# EAGLE design uBlox_camM8_breakout (EAGLE 7.7.0)
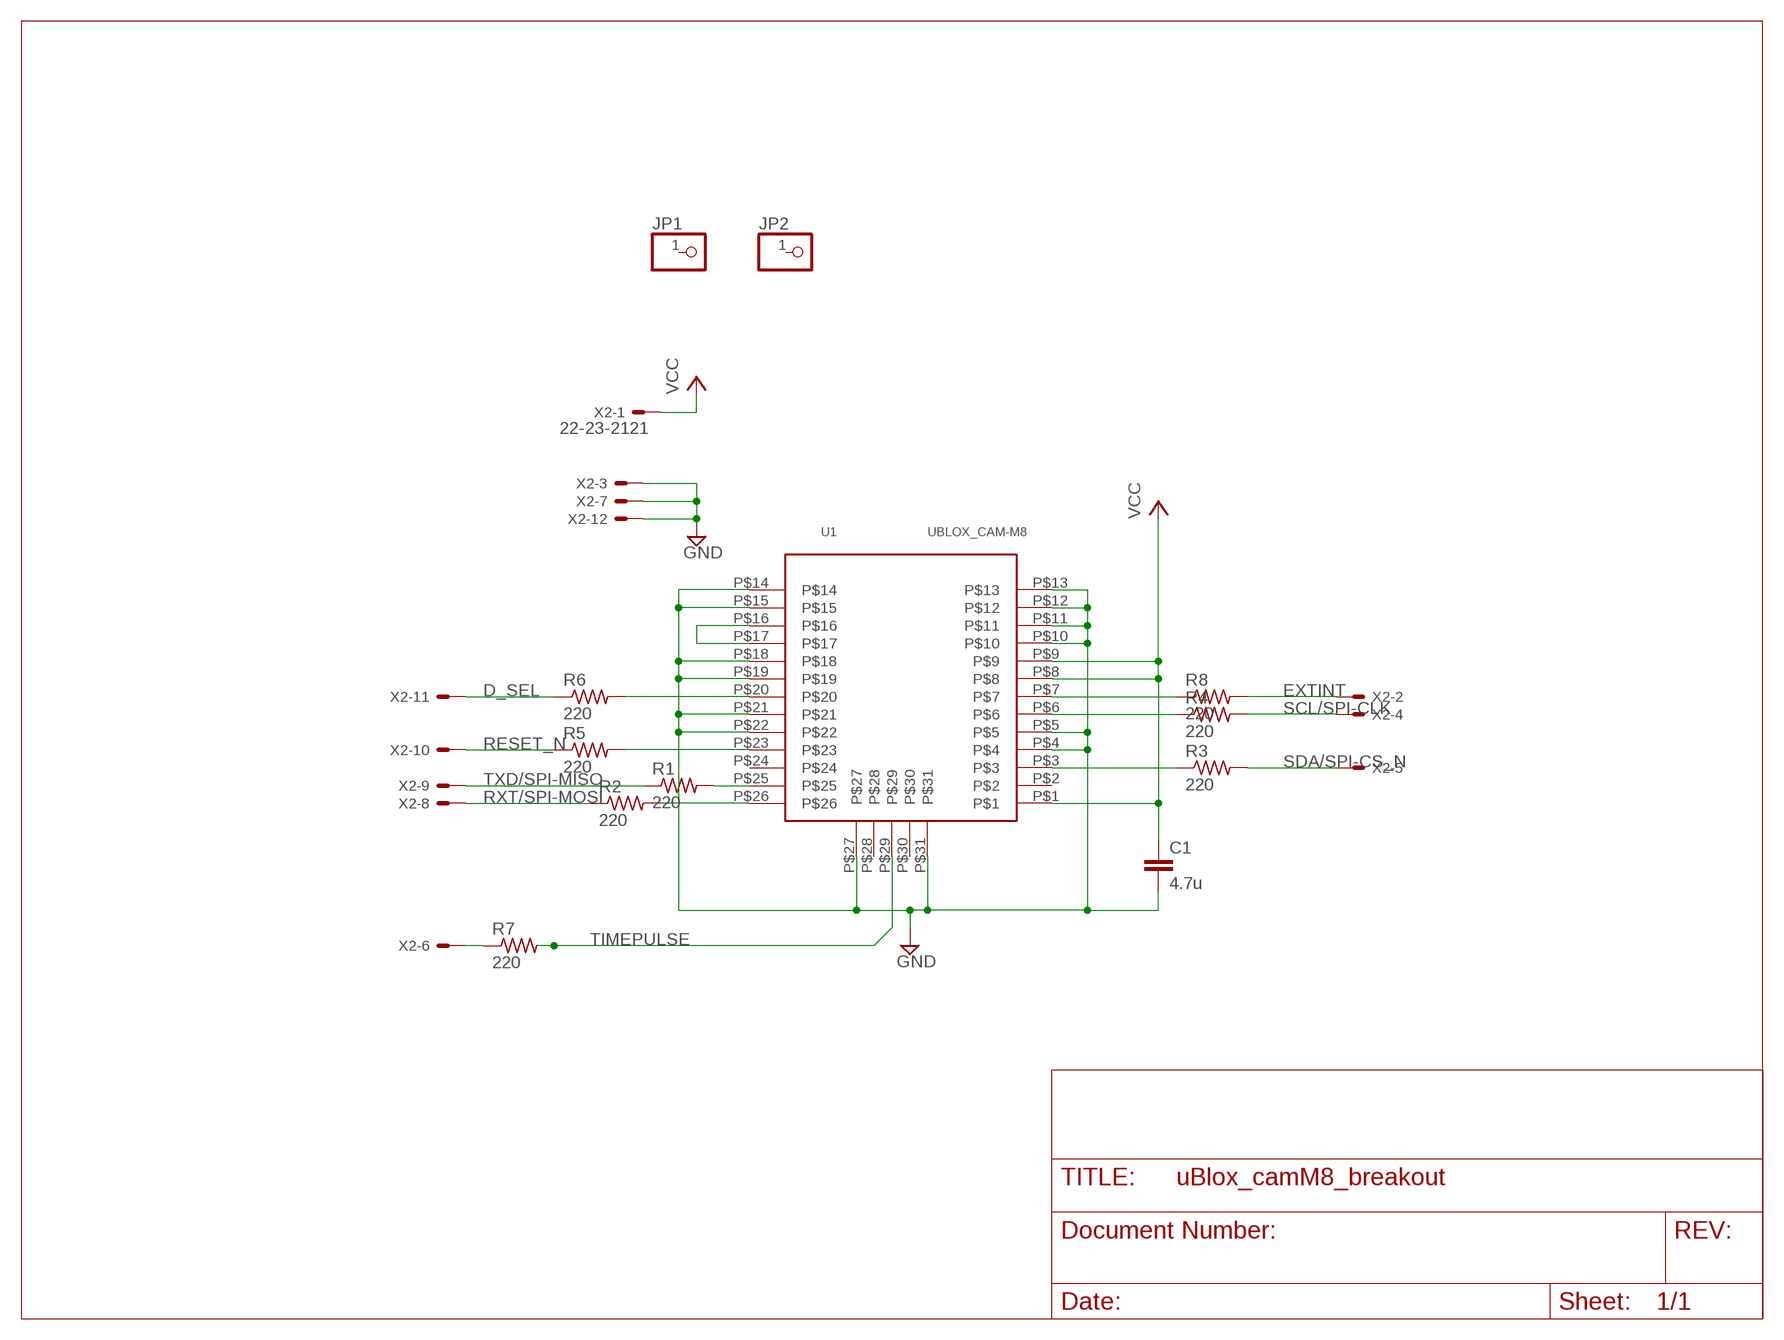
[diagram p0: schematic, sheet 1]

## Parts
C1  4.7u  C-EUC0805  [C0805]
JP1  PINHD-1X1  [1X01]
JP2  PINHD-1X1  [1X01]
R1  220  R-US_R0402  [R0402]
R2  220  R-US_R0402  [R0402]
R3  220  R-US_R0402  [R0402]
R4  220  R-US_R0402  [R0402]
R5  220  R-US_R0402  [R0402]
R6  220  R-US_R0402  [R0402]
R7  220  R-US_R0402  [R0402]
R8  220  R-US_R0402  [R0402]
U1  UBLOX_CAM-M8  [UBLOX_CAM-M8]
X2  22-23-2121  [22-23-2121]

## Nets
D_SEL: R6.1 X2.11
EXTINT: R8.2 X2.2
GND: C1.2 U1.P$4 U1.P$5 U1.P$10 U1.P$11 U1.P$12 U1.P$13 U1.P$14 U1.P$15 U1.P$18 U1.P$19 U1.P$21 U1.P$22 U1.P$27 U1.P$31 X2.3 X2.7 X2.12
N$1: R1.2 U1.P$25
N$2: R2.2 U1.P$26
N$3: U1.P$16 U1.P$17
N$4: R3.1 U1.P$3
N$5: R4.1 U1.P$6
N$6: R8.1 U1.P$7
N$7: R5.2 U1.P$23
N$11: R6.2 U1.P$20
N$14: R7.1 X2.6
RESET_N: R5.1 X2.10
RXT/SPI-MOSI: R2.1 X2.8
SCL/SPI-CLK: R4.2 X2.4
SDA/SPI-CS_N: R3.2 X2.5
TIMEPULSE: R7.2 U1.P$29
TXD/SPI-MISO: R1.1 X2.9
VCC: C1.1 U1.P$1 U1.P$8 U1.P$9 X2.1
Unconnected: JP1.1 JP2.1 U1.P$2 U1.P$24 U1.P$28 U1.P$30

## Library data of the parts
C1 = rcl:C-EU: CAPACITOR, European symbol
JP1 JP2 = pinhead:PINHD-1X1: PIN HEADER
R1-R8 = resistor:R-US_: RESISTOR, American symbol
U1 = uBlox:UBLOX_CAM-M8
X2 = con-molex:22-23-2121: .100" (2.54mm) Center Header - 12 Pin; MF: MOLEX; MPN: 22-23-2121; OC_FARNELL: 1462935; OC_NEWARK: 56H0456

## Board
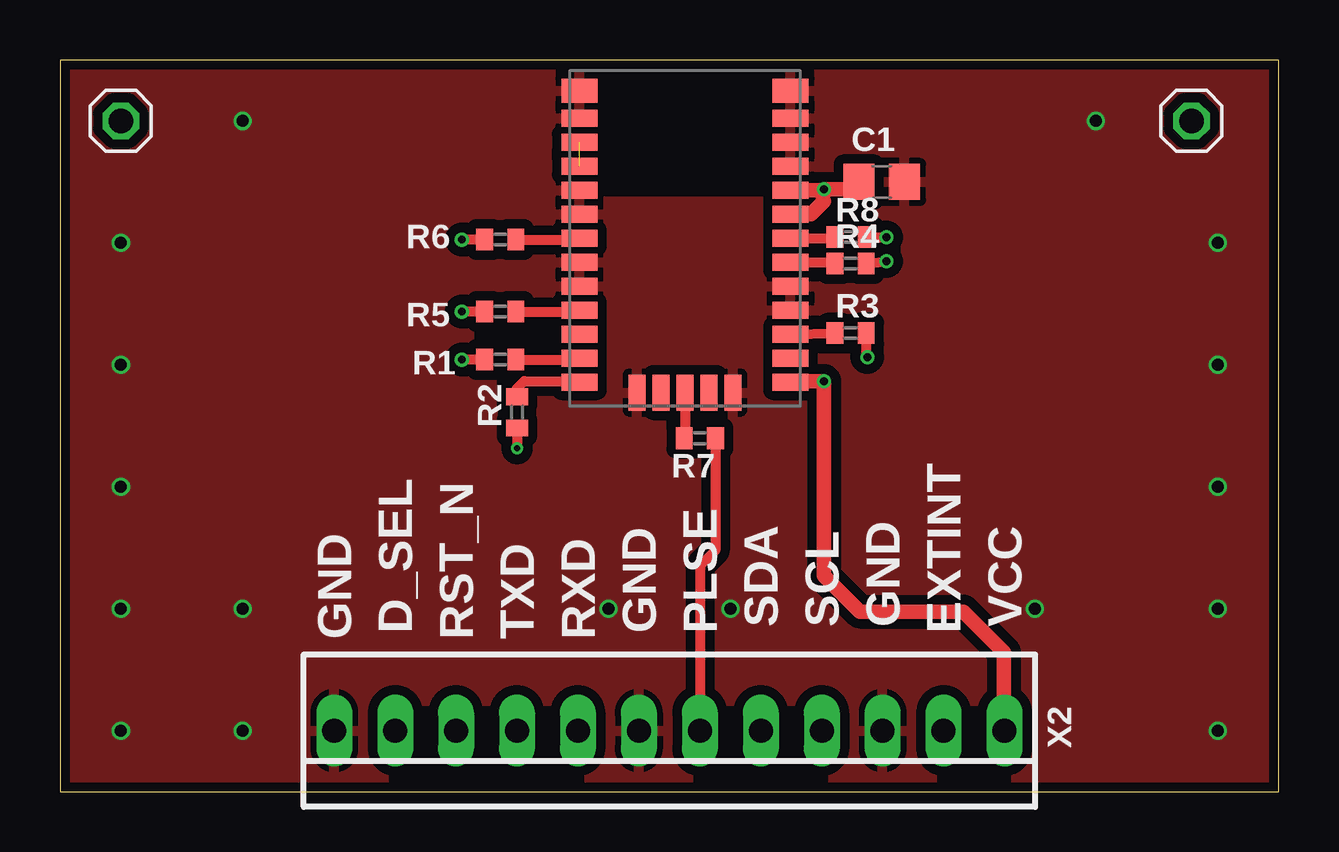
[diagram p1: board, top side]
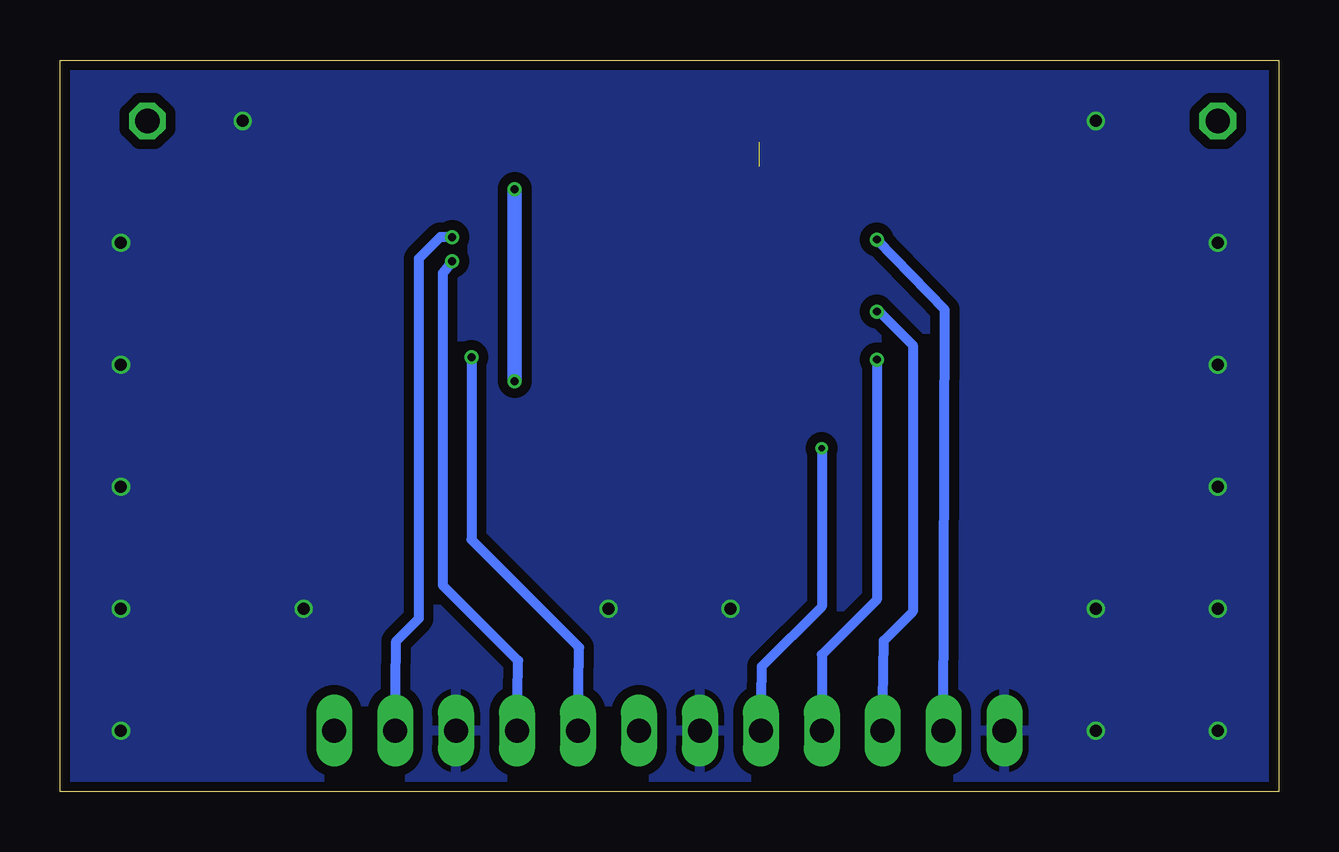
[diagram p2: board, bottom side, seen from below]

Size 50.8 x 30.48 mm. Coordinates in mm from the lower left corner, seen from the top.
Outline: 0,0 50.8,0 50.8,30.48 0,30.48 0,0
Copper layers (1*16): Top 0.035559375mm / dielectric 1.6mm / Bottom 0.035559375mm
Design rules "oshpark-2layer *": minimum track width 6mil, minimum drill 10mil, track to track 6mil, track to pad 6mil, pad to pad 6mil, via to via 6mil, smd to smd 3mil, copper to edge 15mil, drill to drill 6mil, minimum pad ring 5mil, minimum via ring 5mil, stop-mask expansion 2.5mil, vias tented up to drill 20mil, thermal gap 10mil

### Footprints (pad centres in the part's own frame; a part is rotated, then mirrored left to right if it is on the bottom)
C0805 = smd 1.3 x 1.5: 1 -0.95,0; 2 0.95,0
1X01 = drill 1.016 octagon: 1 0,0
R0402 = smd 0.7 x 0.9: 1 -0.65,0; 2 0.65,0
UBLOX_CAM-M8 = smd 0.7 x 1.5: P$1 -6,-4.4; P$2 -5,-4.4; P$3 -4,-4.4; P$4 -3,-4.4; P$5 -2,-4.4; P$6 -1,-4.4; P$7 0,-4.4; P$8 1,-4.4; P$9 2,-4.4; P$10 3,-4.4; P$11 4,-4.4; P$12 5,-4.4; P$15 5,4.4; P$16 4,4.4; P$17 3,4.4; P$18 2,4.4; P$19 1,4.4; P$20 0,4.4; P$21 -1,4.4; P$22 -2,4.4; P$23 -3,4.4; P$24 -4,4.4; P$25 -5,4.4; P$26 -6,4.4 | smd 1 x 1.5: P$13 6.15,-4.4; P$14 6.15,4.4 | smd 1.5 x 0.7: P$27 -6.425,2; P$28 -6.425,1; P$29 -6.425,0; P$30 -6.425,-1; P$31 -6.425,-2
22-23-2121 = drill 1 long: 1 -13.97,0; 2 -11.43,0; 3 -8.89,0; 4 -6.35,0; 5 -3.81,0; 6 -1.27,0; 7 1.27,0; 8 3.81,0; 9 6.35,0; 10 8.89,0; 11 11.43,0; 12 13.97,0

### Placement (x,y rotation side)
C1  34.25,25.4 0 top
JP1  2.54,27.94 90 top
JP2  47.16,27.94 0 top
R1  18.35,18 0 top
R2  19.05,15.8 90 top
R3  32.95,19.1 0 top
R4  32.95,22 0 top
R5  18.35,20 0 top
R6  18.35,23 0 top
R7  26.67,14.72 180 top
R8  32.95,23.1 0 top
U1  26.05,23.05 90 top
X2  25.4,2.54 180 top

### Tracks (layer width: path | path; a pad name or v marks a point on that pad's centre or on a via)
D_SEL  (via drill 0.33)
  Top 0.406: R6.1 v16.75,23
  Bottom 0.406: v16.75,23 13.92,20.07 X2.11
EXTINT  (via drill 0.33)
  Top 0.406: R8.2 v34.45,23.1
  Bottom 0.406: v34.45,23.1 34.95,23.1 35.85,22.2 35.85,7.2 36.78,6.27 X2.2
GND  (via drill 0.5)
  other vias: 2.54,22.86 2.54,17.78 2.54,12.7 2.54,7.62 2.54,2.54 7.62,2.54 7.62,7.62 22.86,7.62 27.94,7.62 40.64,7.62 48.26,7.62 48.26,2.54 48.26,12.7 48.26,17.78 48.26,22.86 43.18,27.94 7.62,27.94
  pour Top (isolate 0.4): 0.1,30.48 50.8,30.48 50.8,0.1 0.1,0.1 0,29.9
  pour Bottom (isolate 0.406): 0,30.48 50.8,30.48 50.8,0 0,0
N$1
  Top 0.406: R1.2 21.6,18 U1.P$25
N$2
  Top 0.406: R2.2 19.05,16.8 19.35,17.1 21.6,17.1 U1.P$26
N$3  (1 unrouted)
N$4
  Top 0.406: U1.P$3 R3.1
N$5
  Top 0.406: U1.P$6 32.05,22.05 R4.1
N$6
  Top 0.406: U1.P$7 32.25,23.05 R8.1
N$7
  Top 0.406: R5.2 21.6,20 U1.P$23
N$11
  Top 0.406: R6.2 21.6,23 U1.P$20
N$14
  Top 0.406: R7.1 27.32,10.05 26.67,9.4 X2.6
RESET_N  (via drill 0.33)
  Top 0.406: R5.1 v16.75,20
  Bottom 0.406: v16.75,20 16.65,20 15.25,18.6 15.25,7.5 16.46,6.29 X2.10
RXT/SPI-MOSI  (via drill 0.25)
  Top 0.406: R2.1 v19.05,14.3
  Bottom 0.406: v19.05,14.3 19.05,7.7 21.54,5.21 X2.8
SCL/SPI-CLK  (via drill 0.33)
  Top 0.406: R4.2 v34.45,22.1
  Bottom 0.406: v34.45,22.1 34.85,21.6 34.85,8.6 31.7,5.45 X2.4
SDA/SPI-CS_N  (via drill 0.33)
  Top 0.406: R3.2 33.6,18.25 v33.65,18.1
  Bottom 0.406: v33.65,18.1 33.65,10.5 29.16,6.01 X2.5
TIMEPULSE
  Top 0.406: U1.P$29 26.05,14.75 R7.2
TXD/SPI-MISO  (via drill 0.33)
  Top 0.406: R1.1 v16.75,18
  Bottom 0.406: v16.75,18 16.75,8 19.05,5.7 X2.9 19.05,3.45
VCC  (via drill 0.33)
  Top 0.61: U1.P$9 31.8,25.05 | 31.8,25.05 v31.85,25.1 33,25.1 C1.1 | U1.P$1 30.5,17.1 v31.85,17.1 31.85,9 33.35,7.5 37.65,7.5 39.35,5.8 39.35,3.43 X2.1 | U1.P$8 31.3,24.05 31.85,24.6 31.8,24.65 31.8,25.05
  Bottom 0.61: v31.85,25.1 v31.85,17.1

### Text on the board
tNames: D_SEL | GND | PLSE | SDA | SCL | GND | EXTINT | VCC | GND | RST_N | TXD | RXD